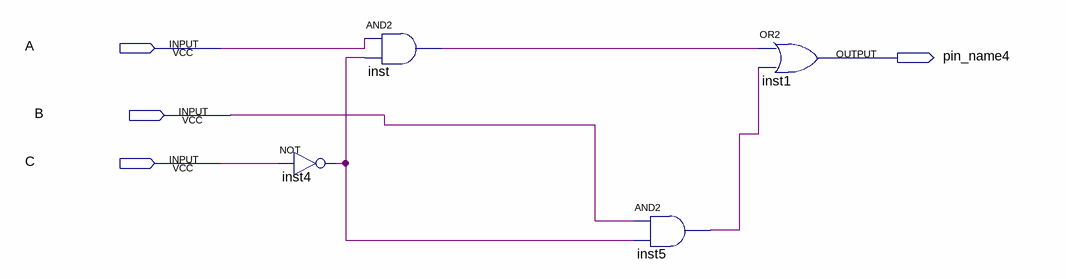
[diagram p0: schematic sheet]
// Quartus schematic Lab2step1.bdf as structural Verilog: 4 symbols, 4 pins
module Lab2step1 (
  input  A,
  input  B,
  input  C,
  output pin_name4
);

  wire inst4_out, inst5_out, inst_out;

  not inst4 (inst4_out, C);
  and inst (inst_out, A, inst4_out);
  and inst5 (inst5_out, B, inst4_out);
  or inst1 (pin_name4, inst_out, inst5_out);
endmodule
